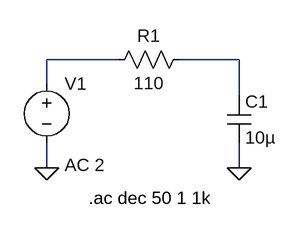
[diagram p0: schematic LPF2.asc]
LPF2.asc, the LTspice schematic file:
Version 4
SHEET 1 880 680
WIRE 128 96 32 96
WIRE 288 96 208 96
WIRE 32 128 32 96
WIRE 288 144 288 96
WIRE 32 240 32 208
WIRE 288 240 288 208
FLAG 288 240 0
FLAG 32 240 0
SYMBOL res 224 80 R90
WINDOW 0 0 56 VBottom 2
WINDOW 3 32 56 VTop 2
SYMATTR InstName R1
SYMATTR Value 110
SYMBOL cap 272 144 R0
SYMATTR InstName C1
SYMATTR Value 10µ
SYMBOL voltage 32 112 R0
WINDOW 123 24 124 Left 2
WINDOW 39 0 0 Left 0
SYMATTR InstName V1
SYMATTR Value ""
SYMATTR Value2 AC 2
TEXT 88 280 Left 2 !.ac dec 50 1 1k

The netlist it stands for:
* LPF2.asc
R1 N002 N001 110
C1 N002 0 10µ
V1 N001 0 AC 2
.ac dec 50 1 1k
.backanno
.end